# EasyEDA Pro project NE555脉宽调试器.eprj

# Schematic Schematic1
Board Name: Board1; Create Date: 2025-08-07; Page Name: P1; Project Name: NE555脉宽调试器; Schematic Name: Schematic1; Update Date: 2025-08-08; Company: 嘉立创EDA; Page Size: A4; Version: V1.0
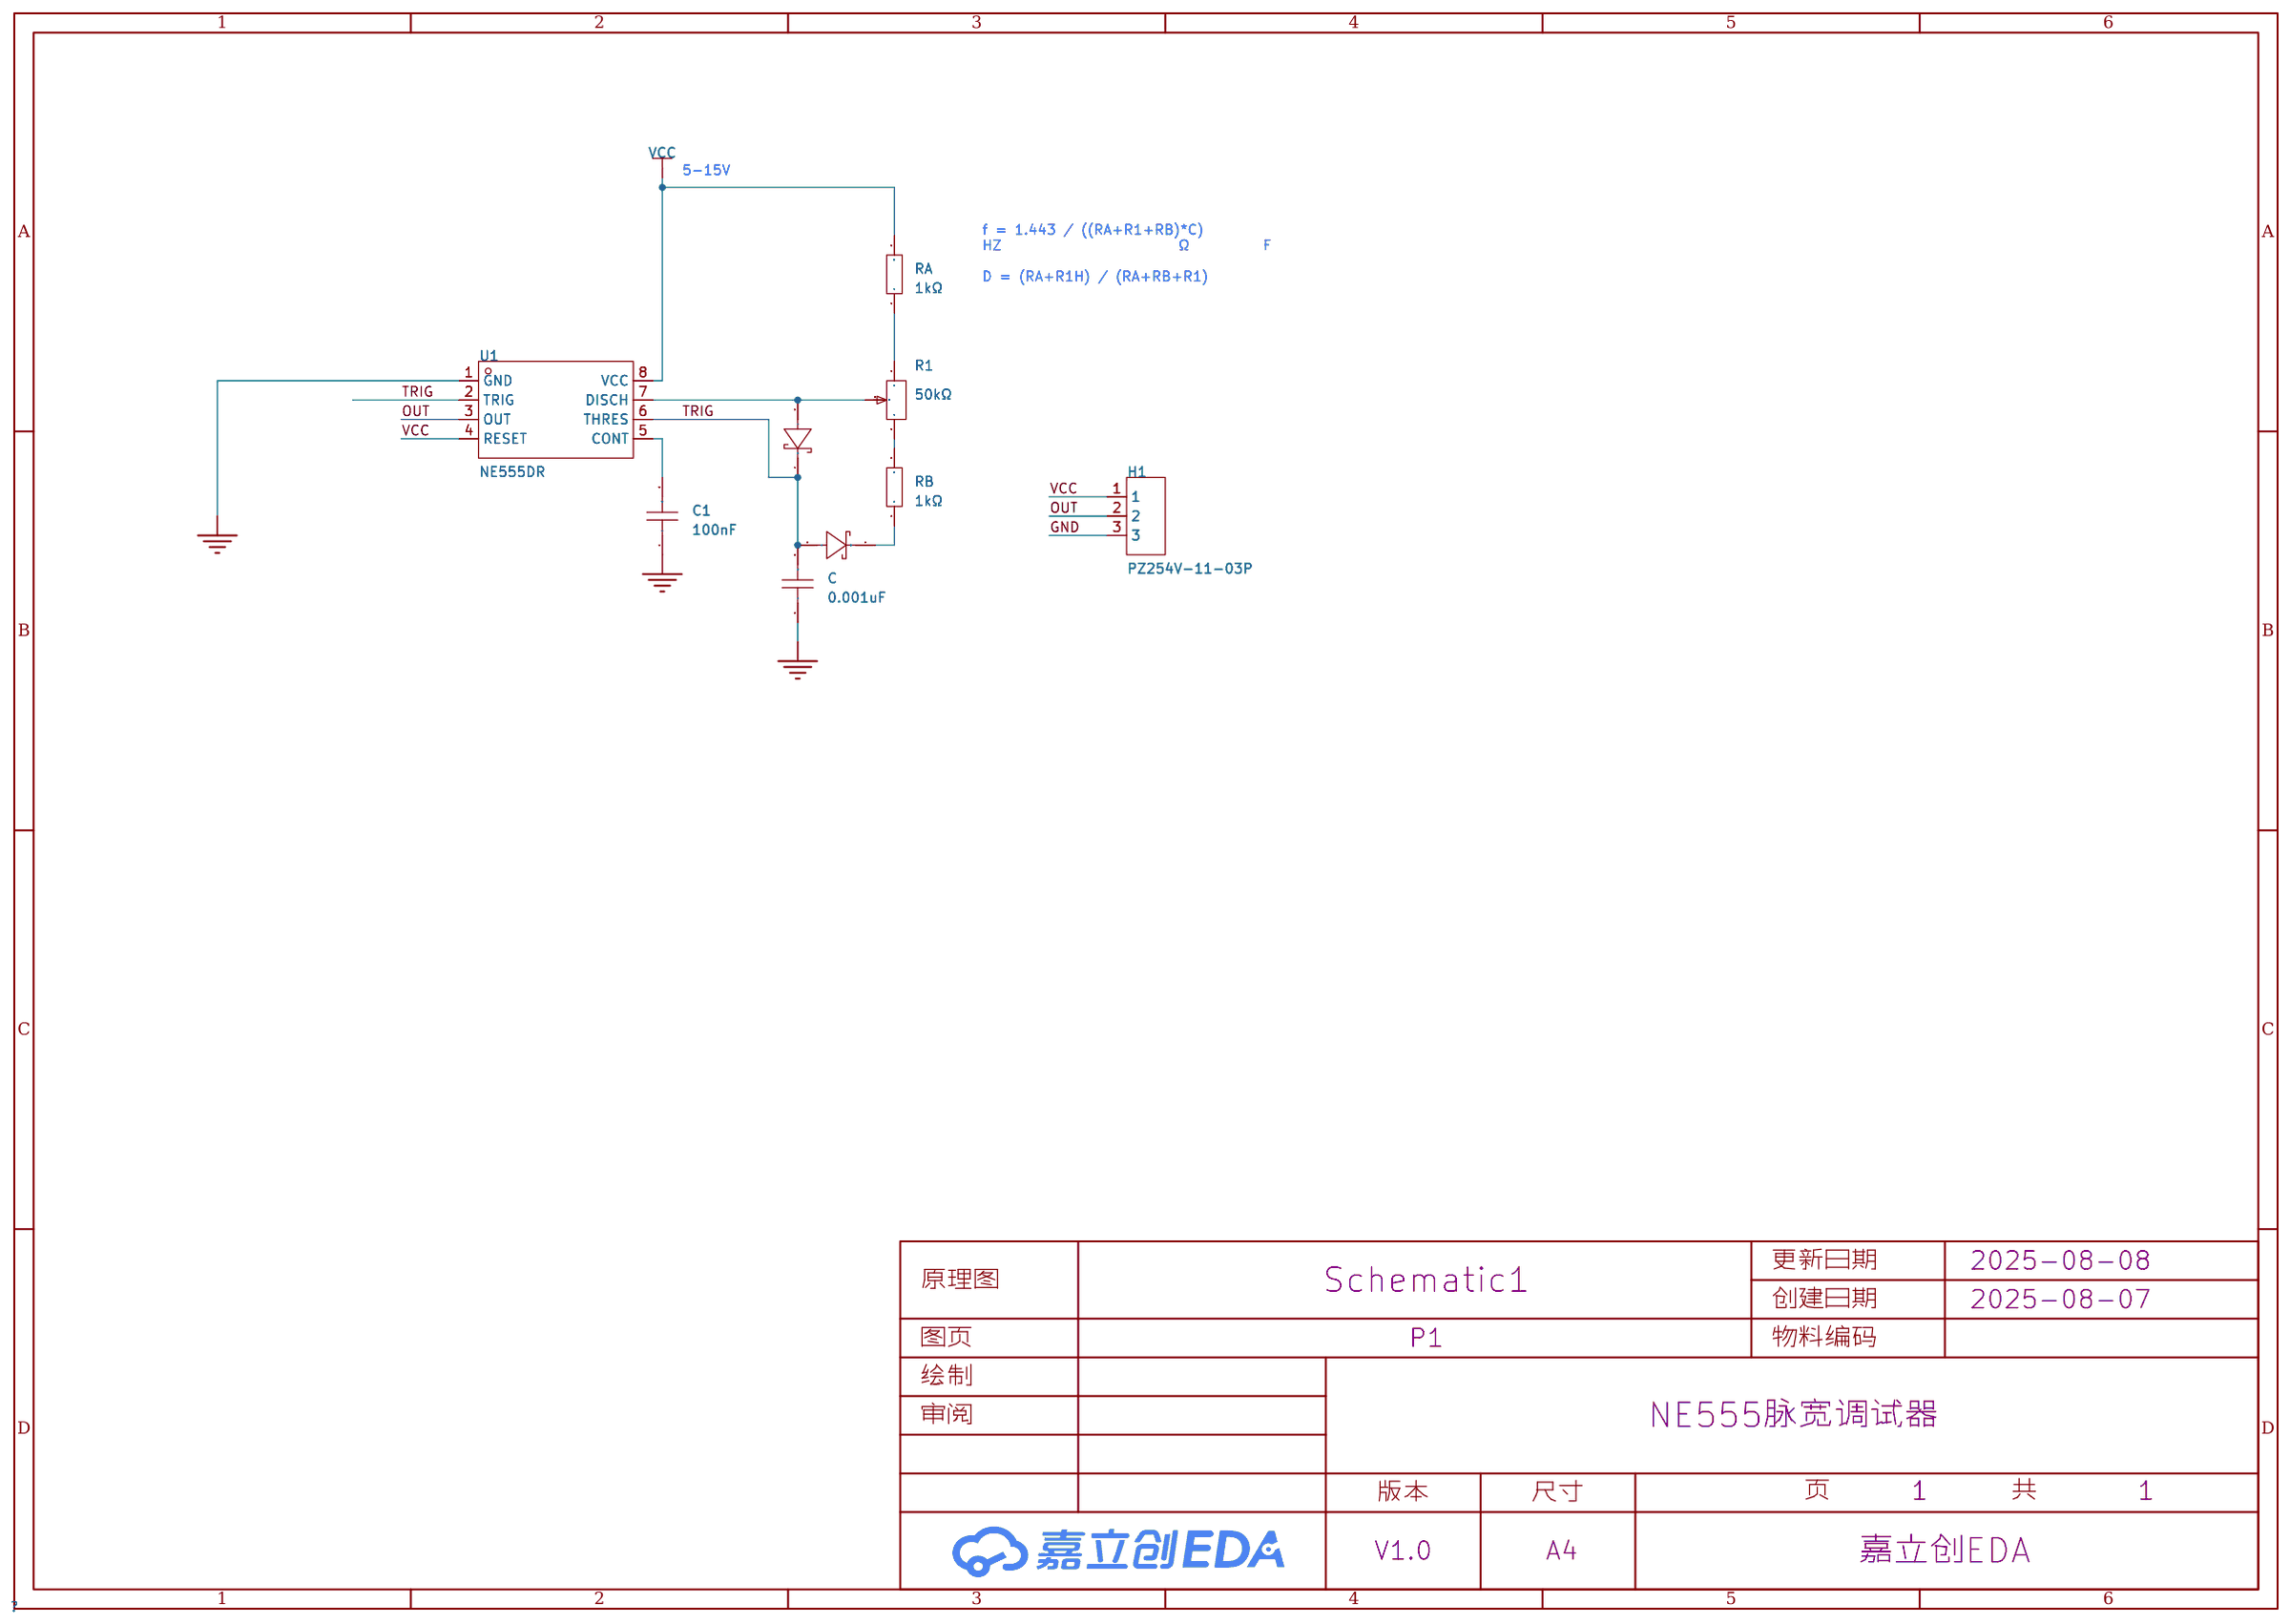
[diagram p0: schematic sheet]

## Parts
C  0.001uF  [C0603]
C1  100nF  [C0603]
H1  PZ254V-11-03P  [HDR-TH_3P-P2.54-V-M]
R1  50kΩ  [res-adj-th_rk097111080j]
RA  1kΩ  [R0603]
RB  1kΩ  [R0603]
U1  NE555DR  [SOP-8_L5.0-W4.0-P1.27-LS6.0-BL]
U2  MBR0520W B2  [SOD-123_L2.7-W1.7-LS3.8-RD]
U3  MBR0520W B2  [SOD-123_L2.7-W1.7-LS3.8-RD]

## Library data of the parts
C = CL10A105KB8NNNC: LCSC Part Name: 1uF ±10% 50V; Supplier Part: C15849; Manufacturer: SAMSUNG(三星); Supplier Footprint: 0603; JLCPCB Part Class: Basic Part; Datasheet: https://atta.szlcsc.com/upload/public/pdf/source/20160218/1457707763339.pdf; Supplier: LCSC; Tolerance: ±10%; Voltage Rated: 50V; Temperature Coefficient: X5R
C1 = CC0603KRX7R9BB104: LCSC Part Name: 100nF ±10% 50V; Supplier Part: C14663; Manufacturer: YAGEO(国巨); Supplier Footprint: 0603; JLCPCB Part Class: Basic Part; Datasheet: https://atta.szlcsc.com/upload/public/pdf/source/20180910/C282072_33301C7F631E79921B82A8DAC6BCC5B3.pdf; Supplier: LCSC; Tolerance: ±10%; Voltage Rating: 50V; Temperature Coefficient: X7R
H1 = PZ254V-11-03P: LCSC Part Name: 1x3P 间距:2.54mm 方针 直插; Supplier Part: C2937625; Manufacturer: XFCN(兴飞); Supplier Footprint: 插件,P=2.54mm; JLCPCB Part Class: 扩展库; Datasheet: https://atta.szlcsc.com/upload/public/pdf/source/20200309/C492402_8335C3D49C4E4C618838D59BB1D024C1.pdf; Supplier: LCSC; Pin Structure: 1x3P; Pitch: 2.54mm; Circluar Pins/Square Pins: 方针; Mounting Type: 直插; Number of Rows: 单排; Number of Pins: 3P; Current Rating: 3A; Voltage Rating (Max): 250V; Length of Mating Pin: 6mm; Insulation Height: 2.5mm; Length of End Connection Pin: 3mm; Operating Temperature: -40℃~+105℃; Color: 黑色
R1 = RK097111080J: Resistance: 100k; Datasheet: https://item.szlcsc.com/datasheet/RK097111080J/98652.html?spm=sc.gbn.xds.a___sc.gbn.hd.ss&lcsc_vid=QVgIA1xXQVVcVlVeQlVdUl0EElkKA1EEElNfVVIFRlkxVlNSTlJaUFNTRFZXVjsOAxUeFF5JWBIBSRccGwIdBEoFGAxBAAgJFQACSQwSGg0%3D
RA RB = 0603WAF1002T5E: LCSC Part Name: 厚膜电阻 10kΩ ±1% 100mW; Supplier Part: C25804; Manufacturer: UNI-ROYAL(厚声); Supplier Footprint: 0603; JLCPCB Part Class: Basic Part; Datasheet: https://atta.szlcsc.com/upload/public/pdf/source/20200306/C422600_1E6D84923E4A46A82E41ADD87F860B5C.pdf; Supplier: LCSC; Type: 厚膜电阻; Tolerance: ±1%; Power(Watts): 100mW; Voltage-Supply(Max): 75V; Temperature Coefficient: ±100ppm/℃; Operating Temperature: -55℃~+155℃
U1 = NE555DR: Supplier Part: C695838; Manufacturer: UMW(友台半导体); Supplier Footprint: SOP-8; JLCPCB Part Class: 扩展库; Datasheet: https://atta.szlcsc.com/upload/public/pdf/source/20231109/10F1BB7F0C3DC760A85BC3699079301C.pdf; Supplier: LCSC
U2 U3 = MBR0520W B2: LCSC Part Name: 电压:20V 电流:500mA; Supplier Part: C2965564; Manufacturer: Slkor(萨科微); Supplier Footprint: SOD-123; JLCPCB Part Class: Extended Part; Datasheet: https://atta.szlcsc.com/upload/public/pdf/source/20220121/DA2582E478F99E574518FC7550548B59.pdf; Supplier: LCSC; Diode Configuration: 独立式; Forward Voltage (Vf@If): 390mV@0.5A; Reverse Voltage (Vr): 20V; Rectified Current: 500mA; Reverse Leakage Current (Ir): 250uA@20V

## Nets
GND: C.1 C1.1 H1.3 U1.1(GND)
VCC: H1.1 RA.2 U1.4(RESET) U1.8(VCC)
OUT: H1.2 U1.3(OUT)
TRIG: C.2 U1.2(TRIG) U1.6(THRES) U2.1(C) U3.2(A)
$1N236: C1.2 U1.5(CONT)
$1N798: R1.2 U1.7(DISCH) U2.2(A)
$1N1175: R1.1 RA.1
$1N1239: RB.1 U3.1(C)
$1N1243: R1.3 RB.2

## Notes on the sheet
- 5-15V
- f = 1.443 / ((RA+R1+RB)*C)
  HZ                        Ω          F
  D = (RA+R1H) / (RA+RB+R1)

# Schematic Schematic2
Board Name: 调频调占空比; Create Date: 2025-08-09; Page Name: P1; Project Name: NE555脉宽调试器; Schematic Name: Schematic2; Update Date: 2025-09-05; Company: 嘉立创EDA; Page Size: A4; Version: V1.0
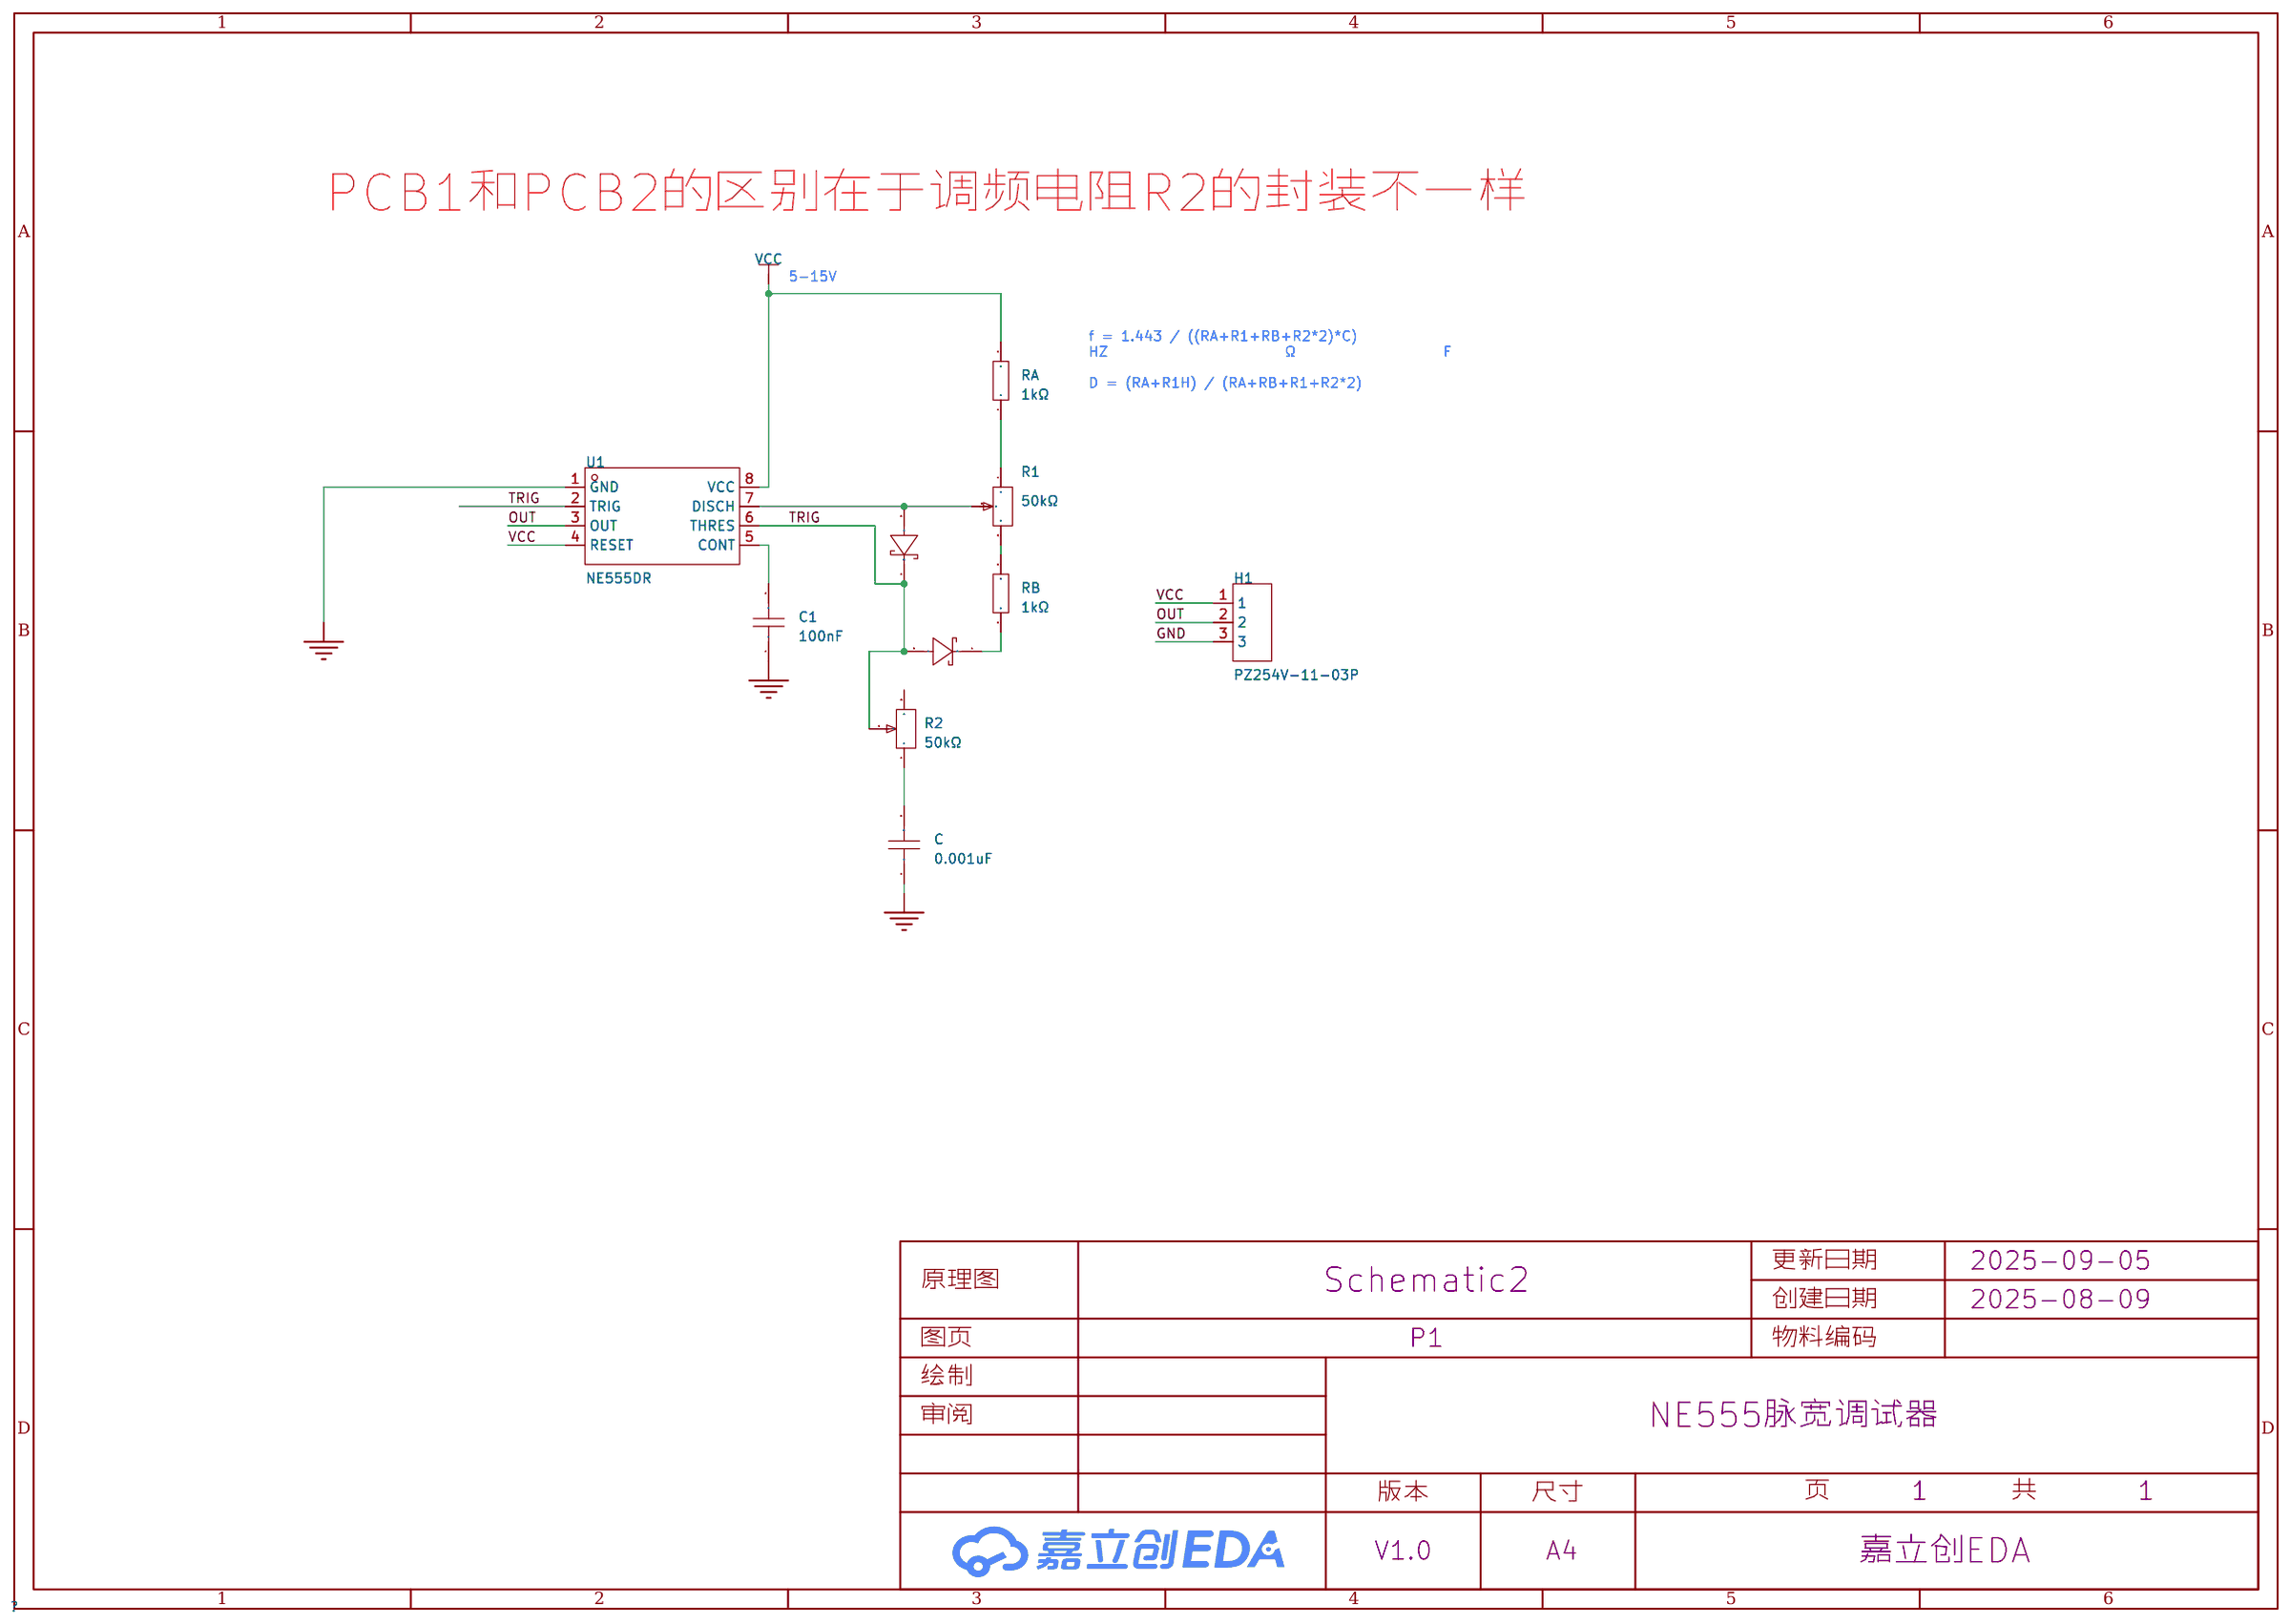
[diagram p1: schematic sheet]

## Parts
C  0.001uF  [C0603]
C1  100nF  [C0603]
H1  PZ254V-11-03P  [HDR-TH_3P-P2.54-V-M]
R1  50kΩ  [res-adj-th_rk097111080j]
R2  50kΩ  [RES-ADJ-TH_3266W]
RA  1kΩ  [R0603]
RB  1kΩ  [R0603]
U1  NE555DR  [SOP-8_L5.0-W4.0-P1.27-LS6.0-BL]
U2  MBR0520W B2  [SOD-123_L2.7-W1.7-LS3.8-RD]
U3  MBR0520W B2  [SOD-123_L2.7-W1.7-LS3.8-RD]

## Library data of the parts
C = CL10A105KB8NNNC: LCSC Part Name: 1uF ±10% 50V; Supplier Part: C15849; Manufacturer: SAMSUNG(三星); Supplier Footprint: 0603; JLCPCB Part Class: Basic Part; Datasheet: https://atta.szlcsc.com/upload/public/pdf/source/20160218/1457707763339.pdf; Supplier: LCSC; Tolerance: ±10%; Voltage Rated: 50V; Temperature Coefficient: X5R
C1 = CC0603KRX7R9BB104: LCSC Part Name: 100nF ±10% 50V; Supplier Part: C14663; Manufacturer: YAGEO(国巨); Supplier Footprint: 0603; JLCPCB Part Class: Basic Part; Datasheet: https://atta.szlcsc.com/upload/public/pdf/source/20180910/C282072_33301C7F631E79921B82A8DAC6BCC5B3.pdf; Supplier: LCSC; Tolerance: ±10%; Voltage Rating: 50V; Temperature Coefficient: X7R
H1 = PZ254V-11-03P: LCSC Part Name: 1x3P 间距:2.54mm 方针 直插; Supplier Part: C2937625; Manufacturer: XFCN(兴飞); Supplier Footprint: 插件,P=2.54mm; JLCPCB Part Class: 扩展库; Datasheet: https://atta.szlcsc.com/upload/public/pdf/source/20200309/C492402_8335C3D49C4E4C618838D59BB1D024C1.pdf; Supplier: LCSC; Pin Structure: 1x3P; Pitch: 2.54mm; Circluar Pins/Square Pins: 方针; Mounting Type: 直插; Number of Rows: 单排; Number of Pins: 3P; Current Rating: 3A; Voltage Rating (Max): 250V; Length of Mating Pin: 6mm; Insulation Height: 2.5mm; Length of End Connection Pin: 3mm; Operating Temperature: -40℃~+105℃; Color: 黑色
R1 = RK097111080J: Resistance: 100k; Datasheet: https://item.szlcsc.com/datasheet/RK097111080J/98652.html?spm=sc.gbn.xds.a___sc.gbn.hd.ss&lcsc_vid=QVgIA1xXQVVcVlVeQlVdUl0EElkKA1EEElNfVVIFRlkxVlNSTlJaUFNTRFZXVjsOAxUeFF5JWBIBSRccGwIdBEoFGAxBAAgJFQACSQwSGg0%3D
R2 = 3266W-1-502_C49190177: LCSC Part Name: 3266W-1-502; Supplier Part: C49190177; Manufacturer: 捷而瑞; Manufacturer Part: 3266W-1-502; Supplier Footprint: 插件-3P,6.8x4.7mm; JLCPCB Part Class: 扩展库; Datasheet: https://atta.szlcsc.com/upload/public/pdf/source/20250717/785DC51DEB89AE7BB58142A6F1C9E75A.pdf; Supplier: LCSC; Tolerance: ±10%; Temperature Coefficient: ±100ppm/℃; Number of Turns: 12
RA RB = 0603WAF1002T5E: LCSC Part Name: 厚膜电阻 10kΩ ±1% 100mW; Supplier Part: C25804; Manufacturer: UNI-ROYAL(厚声); Supplier Footprint: 0603; JLCPCB Part Class: Basic Part; Datasheet: https://atta.szlcsc.com/upload/public/pdf/source/20200306/C422600_1E6D84923E4A46A82E41ADD87F860B5C.pdf; Supplier: LCSC; Type: 厚膜电阻; Tolerance: ±1%; Power(Watts): 100mW; Voltage-Supply(Max): 75V; Temperature Coefficient: ±100ppm/℃; Operating Temperature: -55℃~+155℃
U1 = NE555DR: Supplier Part: C695838; Manufacturer: UMW(友台半导体); Supplier Footprint: SOP-8; JLCPCB Part Class: 扩展库; Datasheet: https://atta.szlcsc.com/upload/public/pdf/source/20231109/10F1BB7F0C3DC760A85BC3699079301C.pdf; Supplier: LCSC
U2 U3 = MBR0520W B2: LCSC Part Name: 电压:20V 电流:500mA; Supplier Part: C2965564; Manufacturer: Slkor(萨科微); Supplier Footprint: SOD-123; JLCPCB Part Class: Extended Part; Datasheet: https://atta.szlcsc.com/upload/public/pdf/source/20220121/DA2582E478F99E574518FC7550548B59.pdf; Supplier: LCSC; Diode Configuration: 独立式; Forward Voltage (Vf@If): 390mV@0.5A; Reverse Voltage (Vr): 20V; Rectified Current: 500mA; Reverse Leakage Current (Ir): 250uA@20V

## Nets
GND: C.1 C1.1 H1.3 U1.1(GND)
VCC: H1.1 RA.2 U1.4(RESET) U1.8(VCC)
OUT: H1.2 U1.3(OUT)
TRIG: R2.2 U1.2(TRIG) U1.6(THRES) U2.1(C) U3.2(A)
$1N458: C1.2 U1.5(CONT)
$1N463: R1.2 U1.7(DISCH) U2.2(A)
$1N464: R1.1 RA.1
$1N465: RB.1 U3.1(C)
$1N466: R1.3 RB.2
$1N557: C.2 R2.1

Not connected (* = marked no-connect by the designer): R2 3

## Notes on the sheet
- PCB1和PCB2的区别在于调频电阻R2的封装不一样
- 5-15V
- f = 1.443 / ((RA+R1+RB+R2*2)*C)
  HZ                        Ω                    F
  D = (RA+R1H) / (RA+RB+R1+R2*2)

# Schematic Schematic3
Board Name: 调频调占空比2; Create Date: 2025-08-09; Page Name: P1; Project Name: NE555脉宽调试器; Schematic Name: Schematic3; Update Date: 2025-08-09; Company: 嘉立创EDA; Page Size: A4; Version: V1.0
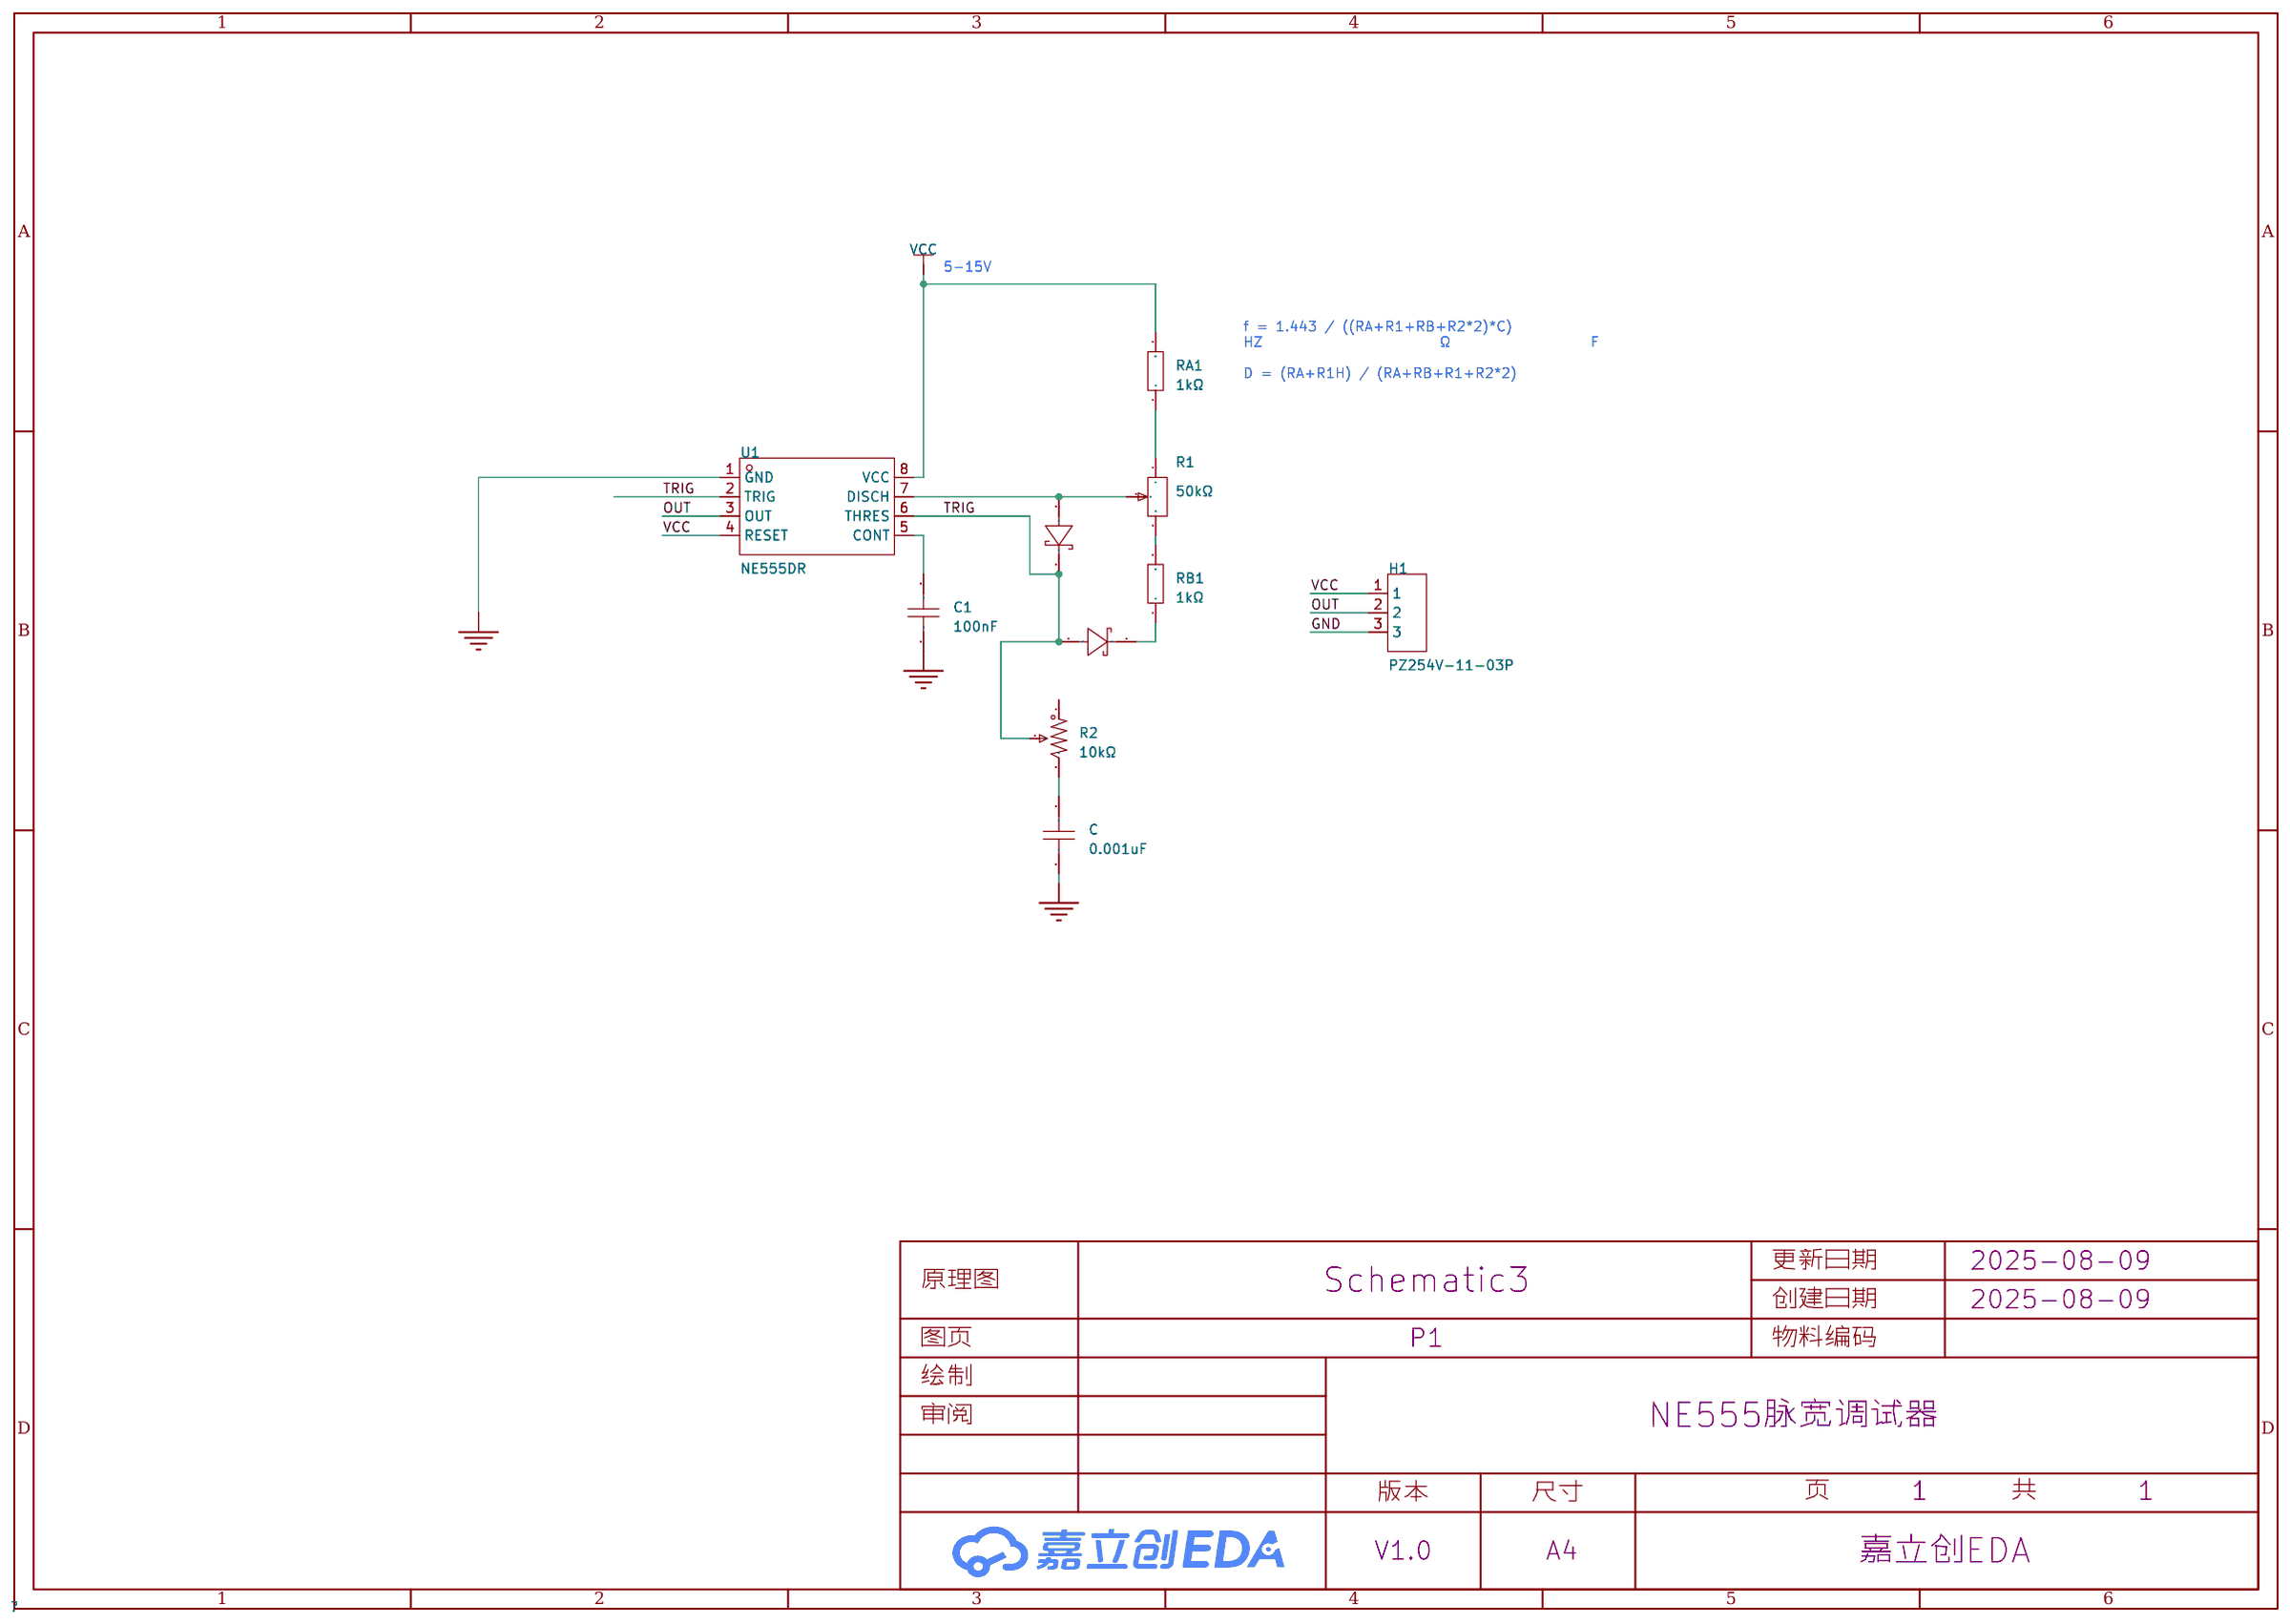
[diagram p2: schematic sheet]

## Parts
C  0.001uF  [C0603]
C1  100nF  [C0603]
H1  PZ254V-11-03P  [HDR-TH_3P-P2.54-V-M]
R1  50kΩ  [res-adj-th_rk097111080j]
R2  10kΩ  [RES-ADJ-TH_3P-L10.0-W10.0-P2.50-L]
RA1  1kΩ  [R0603]
RB1  1kΩ  [R0603]
U1  NE555DR  [SOP-8_L5.0-W4.0-P1.27-LS6.0-BL]
U2  MBR0520W B2  [SOD-123_L2.7-W1.7-LS3.8-RD]
U3  MBR0520W B2  [SOD-123_L2.7-W1.7-LS3.8-RD]

## Library data of the parts
C = CL10A105KB8NNNC: LCSC Part Name: 1uF ±10% 50V; Supplier Part: C15849; Manufacturer: SAMSUNG(三星); Supplier Footprint: 0603; JLCPCB Part Class: Basic Part; Datasheet: https://atta.szlcsc.com/upload/public/pdf/source/20160218/1457707763339.pdf; Supplier: LCSC; Tolerance: ±10%; Voltage Rated: 50V; Temperature Coefficient: X5R
C1 = CC0603KRX7R9BB104: LCSC Part Name: 100nF ±10% 50V; Supplier Part: C14663; Manufacturer: YAGEO(国巨); Supplier Footprint: 0603; JLCPCB Part Class: Basic Part; Datasheet: https://atta.szlcsc.com/upload/public/pdf/source/20180910/C282072_33301C7F631E79921B82A8DAC6BCC5B3.pdf; Supplier: LCSC; Tolerance: ±10%; Voltage Rating: 50V; Temperature Coefficient: X7R
H1 = PZ254V-11-03P: LCSC Part Name: 1x3P 间距:2.54mm 方针 直插; Supplier Part: C2937625; Manufacturer: XFCN(兴飞); Supplier Footprint: 插件,P=2.54mm; JLCPCB Part Class: 扩展库; Datasheet: https://atta.szlcsc.com/upload/public/pdf/source/20200309/C492402_8335C3D49C4E4C618838D59BB1D024C1.pdf; Supplier: LCSC; Pin Structure: 1x3P; Pitch: 2.54mm; Circluar Pins/Square Pins: 方针; Mounting Type: 直插; Number of Rows: 单排; Number of Pins: 3P; Current Rating: 3A; Voltage Rating (Max): 250V; Length of Mating Pin: 6mm; Insulation Height: 2.5mm; Length of End Connection Pin: 3mm; Operating Temperature: -40℃~+105℃; Color: 黑色
R1 = RK097111080J: Resistance: 100k; Datasheet: https://item.szlcsc.com/datasheet/RK097111080J/98652.html?spm=sc.gbn.xds.a___sc.gbn.hd.ss&lcsc_vid=QVgIA1xXQVVcVlVeQlVdUl0EElkKA1EEElNfVVIFRlkxVlNSTlJaUFNTRFZXVjsOAxUeFF5JWBIBSRccGwIdBEoFGAxBAAgJFQACSQwSGg0%3D
R2 = 3296W-1-103: LCSC Part Name: 10kΩ ±10%; Supplier Part: C118954; Manufacturer: BOCHEN(博晨); Supplier Footprint: 插件; JLCPCB Part Class: 扩展库; Datasheet: https://atta.szlcsc.com/upload/public/pdf/source/20171114/C118954_15106326646611117443.pdf; Supplier: LCSC; Tolerance: ±10%
RA1 RB1 = 0603WAF1002T5E: LCSC Part Name: 厚膜电阻 10kΩ ±1% 100mW; Supplier Part: C25804; Manufacturer: UNI-ROYAL(厚声); Supplier Footprint: 0603; JLCPCB Part Class: Basic Part; Datasheet: https://atta.szlcsc.com/upload/public/pdf/source/20200306/C422600_1E6D84923E4A46A82E41ADD87F860B5C.pdf; Supplier: LCSC; Type: 厚膜电阻; Tolerance: ±1%; Power(Watts): 100mW; Voltage-Supply(Max): 75V; Temperature Coefficient: ±100ppm/℃; Operating Temperature: -55℃~+155℃
U1 = NE555DR: Supplier Part: C695838; Manufacturer: UMW(友台半导体); Supplier Footprint: SOP-8; JLCPCB Part Class: 扩展库; Datasheet: https://atta.szlcsc.com/upload/public/pdf/source/20231109/10F1BB7F0C3DC760A85BC3699079301C.pdf; Supplier: LCSC
U2 U3 = MBR0520W B2: LCSC Part Name: 电压:20V 电流:500mA; Supplier Part: C2965564; Manufacturer: Slkor(萨科微); Supplier Footprint: SOD-123; JLCPCB Part Class: Extended Part; Datasheet: https://atta.szlcsc.com/upload/public/pdf/source/20220121/DA2582E478F99E574518FC7550548B59.pdf; Supplier: LCSC; Diode Configuration: 独立式; Forward Voltage (Vf@If): 390mV@0.5A; Reverse Voltage (Vr): 20V; Rectified Current: 500mA; Reverse Leakage Current (Ir): 250uA@20V

## Nets
GND: C.1 C1.1 H1.3 U1.1(GND)
VCC: H1.1 RA1.2 U1.4(RESET) U1.8(VCC)
OUT: H1.2 U1.3(OUT)
TRIG: R2.2 U1.2(TRIG) U1.6(THRES) U2.1(C) U3.2(A)
$1N495: C1.2 U1.5(CONT)
$1N500: R1.2 U1.7(DISCH) U2.2(A)
$1N501: R1.1 RA1.1
$1N502: RB1.1 U3.1(C)
$1N503: R1.3 RB1.2
$1N627: C.2 R2.3

Not connected (* = marked no-connect by the designer): R2 1

## Notes on the sheet
- 5-15V
- f = 1.443 / ((RA+R1+RB+R2*2)*C)
  HZ                        Ω                   F
  D = (RA+R1H) / (RA+RB+R1+R2*2)

# Board PCB3
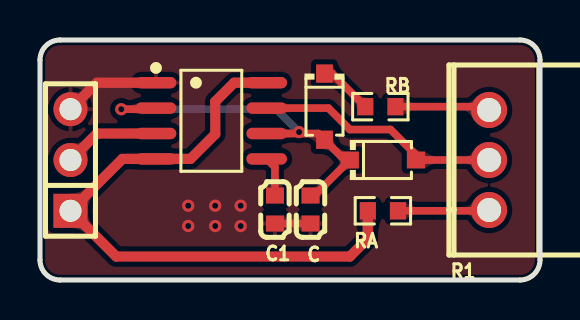
[diagram p3: board, top side]
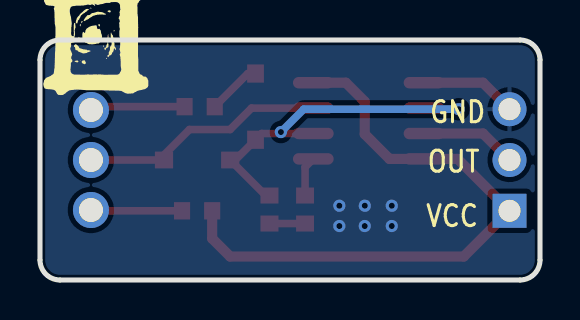
[diagram p4: board, bottom side, seen from below]

Outline 25 x 12 mm; copper layers: Top Layer, Bottom Layer. Coordinates in mm from the lower left corner of the outline.
Outline path: 0,11 0,1 arc(0.29,0.29) 1,0 24,0 arc(24.71,0.29) 25,1 25,11 arc(24.71,11.71) 24,12 1,12 arc(0.29,11.71) 0,11
Stack: Top Layer 0.035mm / Dielectric1 1.51mm FR4 er 4.5 / Bottom Layer 0.035mm

## Design rules (mm)
template: JLCPCB Capability(Two Layers Board)
spacing copperThickness1oz (default): track to track 0.102, other pairs 0.152 to 0.3
spacing copperThickness2oz: track to track 0.203, other pairs 0.152 to 0.3
track width copperThickness1oz (default): min 0.127, default 0.254, max 2.54
track width copperThickness2oz: min 0.203, default 0.254, max 2.54
differential pair differentialPair (default): width min 0.127, default 0.254, max 2.54; gap min 0.152, default 0.152
via viaSize (default): diameter min 0.5, default 0.61, max 10; hole min 0.3, default 0.305, max 6.3

## Placement (name value [footprint] x y rotation side)
C  0.001uF  [C0603]  13.53 3.52 90 top
C1  100nF  [C0603]  11.75 3.52 90 top
H1  PZ254V-11-03P  [HDR-TH_3P-P2.54-V-M]  1.52 6 90 top
R1  50kΩ  [res-adj-th_rk097111080j]  22.45 6 90 top
RA  1kΩ  [R0603]  17.15 3.46 180 top
RB  1kΩ  [R0603]  17.02 8.67 0 top
U1  NE555DR  [SOP-8_L5.0-W4.0-P1.27-LS6.0-BL]  8.57 7.96 270 top
U2  MBR0520W B2  [SOD-123_L2.7-W1.7-LS3.8-RD]  17.15 6 0 top
U3  MBR0520W B2  [SOD-123_L2.7-W1.7-LS3.8-RD]  14.22 8.67 270 top

## Footprints (pads in the part's own frame, mm; a bottom-side part is the same pattern mirrored in y, then rotated)
C0603
  rect 0.8x0.9 smd: 1(-0.7,0) 2(0.7,0)
HDR-TH_3P-P2.54-V-M
  rect 1.7x1.7 hole 1.1: 1(-2.54,0)
  round 1.7 hole 1.1: 2(0,0) 3(2.54,0)
R0603
  rect 0.806x0.864 smd: 1(-0.753,0) 2(0.753,0)
res-adj-th_rk097111080j
  round 1.8 hole 1.2: 1(-2.5,0) 2(0,0) 3(2.5,0)
SOD-123_L2.7-W1.7-LS3.8-RD
  rect 0.91x0.84 smd: 1(-1.655,0) 2(1.655,0)
SOP-8_L5.0-W4.0-P1.27-LS6.0-BL
  oval 0.574x2.035 smd: 1(-1.905,-2.768) 2(-0.635,-2.768) 3(0.635,-2.768) 4(1.905,-2.768) 5(1.905,2.768) 6(0.635,2.768) 7(-0.635,2.768) 8(-1.905,2.768)

## Nets
As in the schematic.

## Via types
v1: diameter 0.61, hole 0.305, Top Layer to Bottom Layer, 8 vias

## Routing (per net, layer and track width the routed paths; a pad name or vN(x,y) marks a point on that pad's centre or on a via; arc(x,y) is an arc through that point)
GND: length 6.6
  Top Layer w0.381: C1.1 C.1
  Top Layer w0.508: U1.1 2.85,9.86 H1.3
  vias: v1(7.41,3.71) v1(7.41,2.7) v1(8.76,3.71) v1(8.76,2.7) v1(10.03,3.71) v1(10.03,2.7)
VCC: length 31
  Top Layer w0.508: RA.2 16.39,2.07 15.49,1.17 3.81,1.17 H1.1 4.12,6.05 U1.4 7.53,6.05 8.76,7.29 8.76,8.92 9.71,9.86 U1.8
OUT: length 4.8
  Top Layer w0.508: H1.2 2.85,7.32 U1.3
TRIG: length 18.5
  Top Layer w0.381: U1.2 5.74,8.54 v1(4.06,8.54) ; C.2 13.71,4.22 U2.1 15.24,6 U3.2 13.91,7.32 U1.6
  Bottom Layer w0.381: v1(12.95,7.4) 11.81,8.54 v1(4.06,8.54)
$1N236: length 2
  Top Layer w0.381: C1.2 11.75,5.64 U1.5
$1N798: length 12.3
  Top Layer w0.381: U1.7 14.42,8.59 15.49,7.52 17.53,7.52 18.8,6.25 U2.2 R1.2
$1N1175: length 4.6
  Top Layer w0.381: RA.1 22.41,3.46 R1.1
$1N1239: length 2.7
  Top Layer w0.381: RB.1 14.61,10.32 U3.1
$1N1243: length 4.8
  Top Layer w0.381: RB.2 22.29,8.67 R1.3

## Copper pours and planes (outline as drawn; the poured copper is in the pictures)
GND on Top Layer: -1.02,13.11 26.16,13.11 26.16,-2.13 -1.02,-2.13
GND on Bottom Layer: -1.91,12.86 25.78,12.86 25.78,-2.64 -1.91,-2.64

Small or netless copper shapes (teardrops, artwork), in the pictures only: 33 on Top Layer, 2 on Bottom Layer

## Text on the board
Bottom Silkscreen Layer: GND | OUT | VCC

# Board PCB1
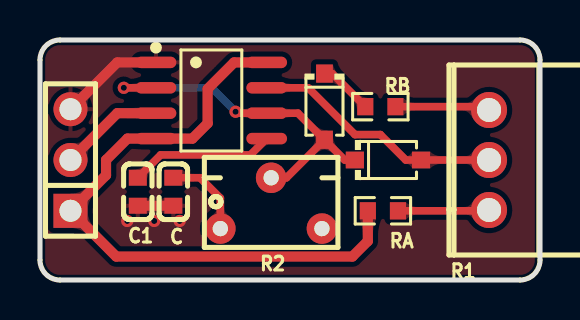
[diagram p5: board, top side]
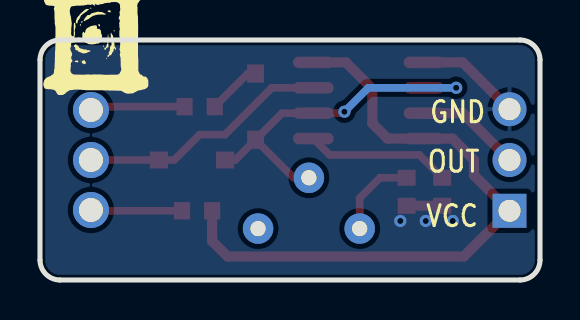
[diagram p6: board, bottom side, seen from below]

Outline 25 x 12 mm; copper layers: Top Layer, Bottom Layer. Coordinates in mm from the lower left corner of the outline.
Outline path: 0,11 0,1 arc(0.29,0.29) 1,0 24,0 arc(24.71,0.29) 25,1 25,11 arc(24.71,11.71) 24,12 1,12 arc(0.29,11.71) 0,11
Stack: Top Layer 0.035mm / Dielectric1 1.51mm FR4 er 4.5 / Bottom Layer 0.035mm

## Design rules (mm)
template: JLCPCB Capability(Two Layers Board)
spacing copperThickness1oz (default): track to track 0.102, other pairs 0.152 to 0.3
spacing copperThickness2oz: track to track 0.203, other pairs 0.152 to 0.3
track width copperThickness1oz (default): min 0.127, default 0.254, max 2.54
track width copperThickness2oz: min 0.203, default 0.254, max 2.54
differential pair differentialPair (default): width min 0.127, default 0.254, max 2.54; gap min 0.152, default 0.152
via viaSize (default): diameter min 0.5, default 0.61, max 10; hole min 0.3, default 0.305, max 6.3

## Placement (name value [footprint] x y rotation side)
C  0.001uF  [C0603]  6.67 4.41 90 top
C1  100nF  [C0603]  4.89 4.41 90 top
H1  PZ254V-11-03P  [HDR-TH_3P-P2.54-V-M]  1.52 6 90 top
R1  50kΩ  [res-adj-th_rk097111080j]  22.45 6 90 top
R2  50kΩ  [RES-ADJ-TH_3266W]  11.56 3.84 90 top
RA  1kΩ  [R0603]  17.15 3.46 180 top
RB  1kΩ  [R0603]  17.02 8.67 0 top
U1  NE555DR  [SOP-8_L5.0-W4.0-P1.27-LS6.0-BL]  8.57 8.98 270 top
U2  MBR0520W B2  [SOD-123_L2.7-W1.7-LS3.8-RD]  17.4 6 0 top
U3  MBR0520W B2  [SOD-123_L2.7-W1.7-LS3.8-RD]  14.22 8.67 270 top

## Footprints (pads in the part's own frame, mm; a bottom-side part is the same pattern mirrored in y, then rotated)
C0603
  rect 0.8x0.9 smd: 1(-0.7,0) 2(0.7,0)
HDR-TH_3P-P2.54-V-M
  rect 1.7x1.7 hole 1.1: 1(-2.54,0)
  round 1.7 hole 1.1: 2(0,0) 3(2.54,0)
R0603
  rect 0.806x0.864 smd: 1(-0.753,0) 2(0.753,0)
RES-ADJ-TH_3266W
  round 1.524 hole 0.762: 1(-1.27,2.54) 2(1.27,0) 3(-1.27,-2.54)
res-adj-th_rk097111080j
  round 1.8 hole 1.2: 1(-2.5,0) 2(0,0) 3(2.5,0)
SOD-123_L2.7-W1.7-LS3.8-RD
  rect 0.91x0.84 smd: 1(-1.655,0) 2(1.655,0)
SOP-8_L5.0-W4.0-P1.27-LS6.0-BL
  oval 0.574x2.035 smd: 1(-1.905,-2.768) 2(-0.635,-2.768) 3(0.635,-2.768) 4(1.905,-2.768) 5(1.905,2.768) 6(0.635,2.768) 7(-0.635,2.768) 8(-1.905,2.768)

## Nets
As in the schematic.

Pads without a net: R2 3

## Via types
v1: diameter 0.61, hole 0.305, Top Layer to Bottom Layer, 5 vias

## Routing (per net, layer and track width the routed paths; a pad name or vN(x,y) marks a point on that pad's centre or on a via; arc(x,y) is an arc through that point)
GND: length 7
  Top Layer w0.508: C1.1 C.1 ; U1.1 3.86,10.88 H1.3
  vias: v1(4.36,2.95) v1(5.71,2.95) v1(6.99,2.95)
VCC: length 32
  Top Layer w0.508: RA.2 16.39,1.94 15.62,1.17 3.81,1.17 H1.1 3.3,5.24 3.3,6 4.37,7.07 U1.4 7.62,7.07 8.38,7.83 8.38,9.56 9.71,10.88 U1.8
OUT: length 5.2
  Top Layer w0.508: U1.3 3.86,8.34 H1.2
TRIG: length 18.1
  Top Layer w0.381: U3.2 12.9,8.34 U1.6 9.85,8.34 v1(9.78,8.41) ; U3.2 15.24,6 U2.1 ; U3.2 12.32,5.11 11.56,5.11 ; U1.2 v1(4.19,9.61)
  Bottom Layer w0.381: v1(4.19,9.61) 8.58,9.61 v1(9.78,8.41)
$1N458: length 7.3
  Top Layer w0.381: C1.2 6.03,6.25 10.52,6.25 U1.5
$1N463: length 12.6
  Top Layer w0.381: R1.2 U2.2 18.29,6 17.02,7.27 15.75,7.27 13.41,9.61 U1.7
$1N464: length 4.6
  Top Layer w0.381: RA.1 22.41,3.46 R1.1
$1N465: length 2.7
  Top Layer w0.381: RB.1 14.61,10.32 U3.1
$1N466: length 4.8
  Top Layer w0.381: RB.2 22.29,8.67 R1.3
$1N557: length 4.3
  Top Layer w0.381: R2.1 9.02,4.09 8,5.11 C.2

## Copper pours and planes (outline as drawn; the poured copper is in the pictures)
GND on Top Layer: -1.14,13.87 25.78,13.87 25.78,-1.49 -1.14,-1.49
GND on Bottom Layer: -0.63,13.49 25.91,13.49 25.91,-1.62 -0.63,-1.62

Small or netless copper shapes (teardrops, artwork), in the pictures only: 36 on Top Layer, 2 on Bottom Layer

## Text on the board
Bottom Silkscreen Layer: GND | OUT | VCC

# Board PCB2
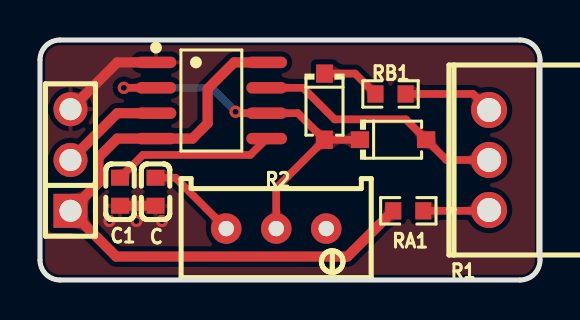
[diagram p7: board, top side]
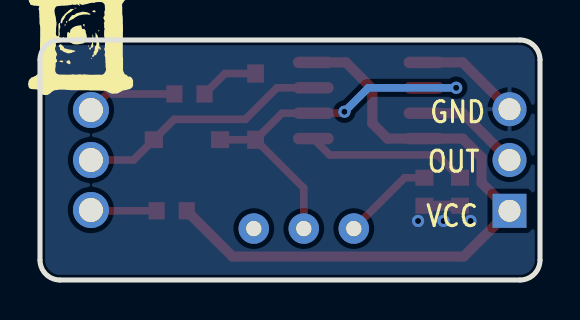
[diagram p8: board, bottom side, seen from below]

Outline 25 x 12 mm; copper layers: Top Layer, Bottom Layer. Coordinates in mm from the lower left corner of the outline.
Outline path: 0,11 0,1 arc(0.29,0.29) 1,0 24,0 arc(24.71,0.29) 25,1 25,11 arc(24.71,11.71) 24,12 1,12 arc(0.29,11.71) 0,11
Stack: Top Layer 0.035mm / Dielectric1 1.51mm FR4 er 4.5 / Bottom Layer 0.035mm

## Design rules (mm)
template: JLCPCB Capability(Two Layers Board)
spacing copperThickness1oz (default): track to track 0.102, other pairs 0.152 to 0.3
spacing copperThickness2oz: track to track 0.203, other pairs 0.152 to 0.3
track width copperThickness1oz (default): min 0.127, default 0.254, max 2.54
track width copperThickness2oz: min 0.203, default 0.254, max 2.54
differential pair differentialPair (default): width min 0.127, default 0.254, max 2.54; gap min 0.152, default 0.152
via viaSize (default): diameter min 0.5, default 0.61, max 10; hole min 0.3, default 0.305, max 6.3

## Placement (name value [footprint] x y rotation side)
C  0.001uF  [C0603]  5.78 4.41 90 top
C1  100nF  [C0603]  4 4.41 90 top
H1  PZ254V-11-03P  [HDR-TH_3P-P2.54-V-M]  1.52 6 90 top
R1  50kΩ  [res-adj-th_rk097111080j]  22.45 6 90 top
R2  10kΩ  [RES-ADJ-TH_3P-L10.0-W10.0-P2.50-L]  11.81 2.57 180 top
RA1  1kΩ  [R0603]  18.41 3.46 180 top
RB1  1kΩ  [R0603]  17.53 9.3 0 top
U1  NE555DR  [SOP-8_L5.0-W4.0-P1.27-LS6.0-BL]  8.57 8.98 270 top
U2  MBR0520W B2  [SOD-123_L2.7-W1.7-LS3.8-RD]  17.65 7.02 0 top
U3  MBR0520W B2  [SOD-123_L2.7-W1.7-LS3.8-RD]  14.22 8.67 270 top

## Footprints (pads in the part's own frame, mm; a bottom-side part is the same pattern mirrored in y, then rotated)
C0603
  rect 0.8x0.9 smd: 1(-0.7,0) 2(0.7,0)
HDR-TH_3P-P2.54-V-M
  rect 1.7x1.7 hole 1.1: 1(-2.54,0)
  round 1.7 hole 1.1: 2(0,0) 3(2.54,0)
R0603
  rect 0.806x0.864 smd: 1(-0.753,0) 2(0.753,0)
RES-ADJ-TH_3P-L10.0-W10.0-P2.50-L
  round 1.524 hole 0.762: 1(-2.5,0) 2(0,0) 3(2.5,0)
res-adj-th_rk097111080j
  round 1.8 hole 1.2: 1(-2.5,0) 2(0,0) 3(2.5,0)
SOD-123_L2.7-W1.7-LS3.8-RD
  rect 0.91x0.84 smd: 1(-1.655,0) 2(1.655,0)
SOP-8_L5.0-W4.0-P1.27-LS6.0-BL
  oval 0.574x2.035 smd: 1(-1.905,-2.768) 2(-0.635,-2.768) 3(0.635,-2.768) 4(1.905,-2.768) 5(1.905,2.768) 6(0.635,2.768) 7(-0.635,2.768) 8(-1.905,2.768)

## Nets
As in the schematic.

Pads without a net: R2 1

## Via types
v1: diameter 0.61, hole 0.305, Top Layer to Bottom Layer, 5 vias

## Routing (per net, layer and track width the routed paths; a pad name or vN(x,y) marks a point on that pad's centre or on a via; arc(x,y) is an arc through that point)
GND: length 7
  Top Layer w0.508: C1.1 C.1 ; U1.1 3.86,10.88 H1.3
  vias: v1(3.47,2.95) v1(4.82,2.95) v1(6.1,2.95)
VCC: length 32.7
  Top Layer w0.508: U1.8 9.71,10.88 8.38,9.56 8.38,7.83 7.62,7.07 U1.4 3.86,7.07 2.92,6.13 2.92,4.86 H1.1 3.81,1.17 15.38,1.17 RA1.2
OUT: length 5.2
  Top Layer w0.508: H1.2 3.86,8.34 U1.3
TRIG: length 19.9
  Top Layer w0.381: v1(9.78,8.41) 9.85,8.34 U1.6 12.9,8.34 U3.2 ; U2.1 15.99,7.01 U3.2 ; R2.2 11.81,4.6 U3.2 ; U1.2 v1(4.19,9.61)
  Bottom Layer w0.381: v1(4.19,9.61) 8.58,9.61 v1(9.78,8.41)
$1N495: length 8.1
  Top Layer w0.381: C1.2 5.14,6.25 10.52,6.25 U1.5
$1N500: length 12.6
  Top Layer w0.381: U1.7 13.15,9.61 14.73,8.03 18.29,8.03 U2.2 20.32,6 R1.2
$1N501: length 3.3
  Top Layer w0.381: RA1.1 22.41,3.46 R1.1
$1N502: length 3
  Top Layer w0.381: U3.1 15.75,10.32 RB1.1
$1N503: length 4.5
  Top Layer w0.381: RB1.2 21.65,9.3 R1.3
$1N627: length 4.6
  Top Layer w0.381: C.2 6.77,5.11 R2.3

## Copper pours and planes (outline as drawn; the poured copper is in the pictures)
GND on Top Layer: -1.14,13.87 25.78,13.87 25.78,-1.49 -1.14,-1.49
GND on Bottom Layer: -0.63,13.49 25.91,13.49 25.91,-1.62 -0.63,-1.62

Small or netless copper shapes (teardrops, artwork), in the pictures only: 35 on Top Layer, 2 on Bottom Layer

## Text on the board
Bottom Silkscreen Layer: GND | OUT | VCC
